# EAGLE design Iridium_9603_Beacon (EAGLE 7.6.0)

## Sheet 1 of 5
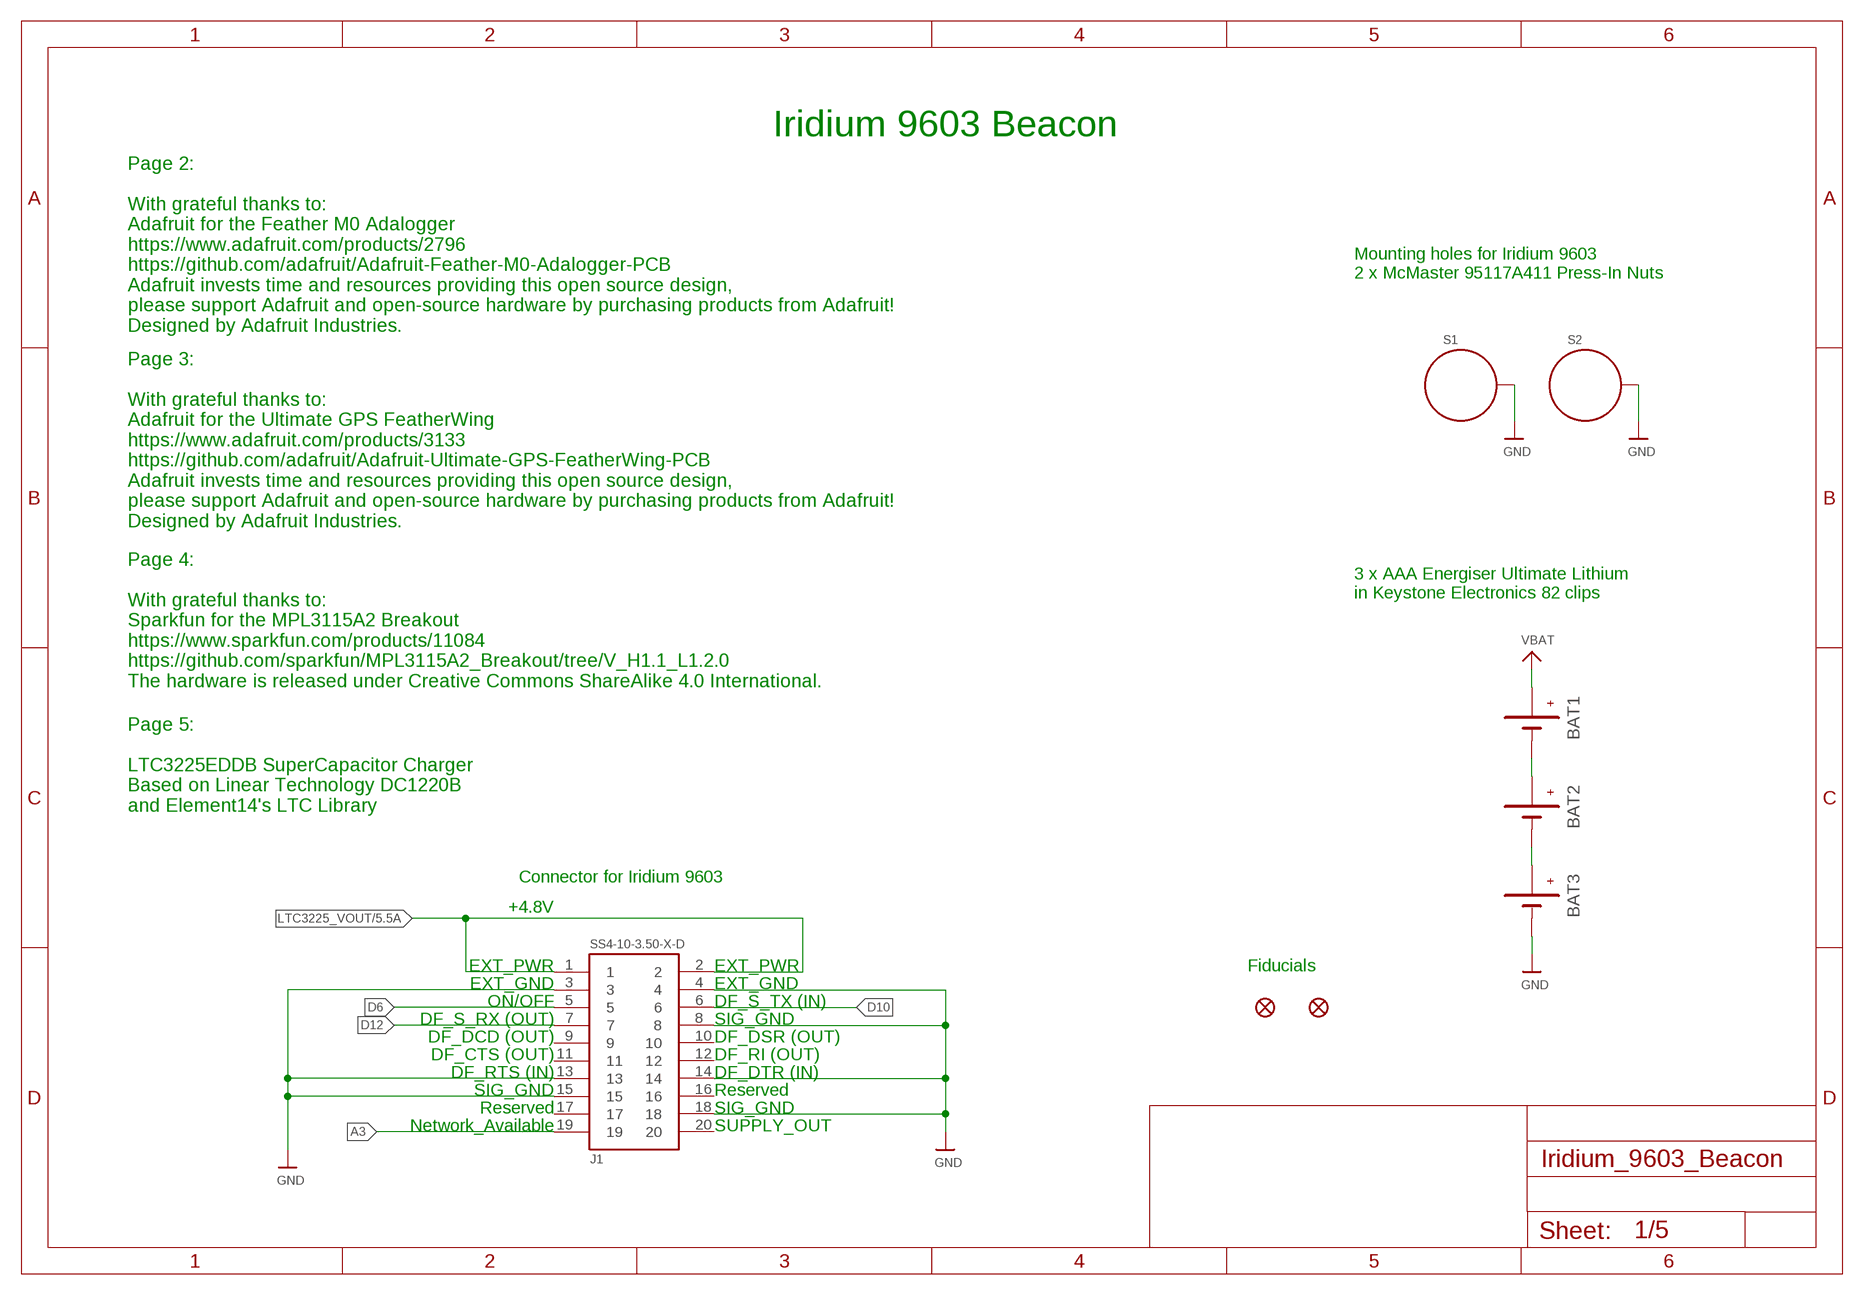
[diagram p0: schematic, sheet 1]

### Parts
BAT1  BATTERYKEYSTONE82  [BATTERY-AAA-KEYSTONE82]
BAT2  BATTERYKEYSTONE82  [BATTERY-AAA-KEYSTONE82]
BAT3  BATTERYKEYSTONE82  [BATTERY-AAA-KEYSTONE82]
FD1  FIDUCIAL1X2  [FIDUCIAL-1X2]
FD2  FIDUCIAL1X2  [FIDUCIAL-1X2]
J1  SS4-10-3.50-X-D  [SS4-10-3.50-X-D]
S1  STANDOFF_ELECTRICALMCMASTER-95117A411  [STANDOFF-ELECTRICAL-MCMASTER-95117A411]
S2  STANDOFF_ELECTRICALMCMASTER-95117A411  [STANDOFF-ELECTRICAL-MCMASTER-95117A411]

### Nets
A3: J1.19 ; also sheet 2
D6: J1.5 ; also sheet 2
D10: J1.6 ; also sheet 2
D12: J1.7 ; also sheet 2
GND: BAT3.GND@1(-) BAT3.GND@2(-) J1.3 J1.4 J1.8 J1.13 J1.14 J1.15 J1.18 S1.P1 S2.P1 ; also sheet 2,3,4,5
LTC3225_VOUT: J1.1 J1.2 ; also sheet 5
N$1: BAT2.GND@1(-) BAT2.GND@2(-) BAT3.PWR@1(+) BAT3.PWR@2(+)
N$3: BAT1.GND@1(-) BAT1.GND@2(-) BAT2.PWR@1(+) BAT2.PWR@2(+)
VBAT: BAT1.PWR@1(+) BAT1.PWR@2(+) ; also sheet 2,5
Unconnected: J1.9 J1.10 J1.11 J1.12 J1.16 J1.17 J1.20

### Notes on the sheet
- Iridium 9603 Beacon
- Mounting holes for Iridium 9603
  2 x McMaster 95117A411 Press-In Nuts
- Page 2:
  
  With grateful thanks to:
  Adafruit for the Feather M0 Adalogger
  https://www.adafruit.com/products/2796
  https://github.com/adafruit/Adafruit-Feather-M0-Adalogger-PCB
  Adafruit invests time and resources providing this open source design,
  please support Adafruit and open-source hardware by purchasing products from Adafruit!
  Designed by Adafruit Industries.
- Page 3:
  
  With grateful thanks to:
  Adafruit for the Ultimate GPS FeatherWing
  https://www.adafruit.com/products/3133
  https://github.com/adafruit/Adafruit-Ultimate-GPS-FeatherWing-PCB
  Adafruit invests time and resources providing this open source design,
  please support Adafruit and open-source hardware by purchasing products from Adafruit!
  Designed by Adafruit Industries.
- 3 x AAA Energiser Ultimate Lithium
  in Keystone Electronics 82 clips
- Page 4:
  
  With grateful thanks to:
  Sparkfun for the MPL3115A2 Breakout
  https://www.sparkfun.com/products/11084
  https://github.com/sparkfun/MPL3115A2_Breakout/tree/V_H1.1_L1.2.0
  The hardware is released under Creative Commons ShareAlike 4.0 International.
- Page 5:
  
  LTC3225EDDB SuperCapacitor Charger
  Based on Linear Technology DC1220B
  and Element14's LTC Library
- Connector for Iridium 9603
- +4.8V
- EXT_PWR | EXT_PWR | Fiducials
- EXT_GND | EXT_GND
- ON/OFF | DF_S_TX (IN)
- DF_S_RX (OUT) | SIG_GND
- DF_DCD (OUT) | DF_DSR (OUT)
- DF_CTS (OUT) | DF_RI (OUT)
- DF_RTS (IN) | DF_DTR (IN)
- SIG_GND | Reserved
- Reserved | SIG_GND
- Network_Available | SUPPLY_OUT

## Sheet 2 of 5
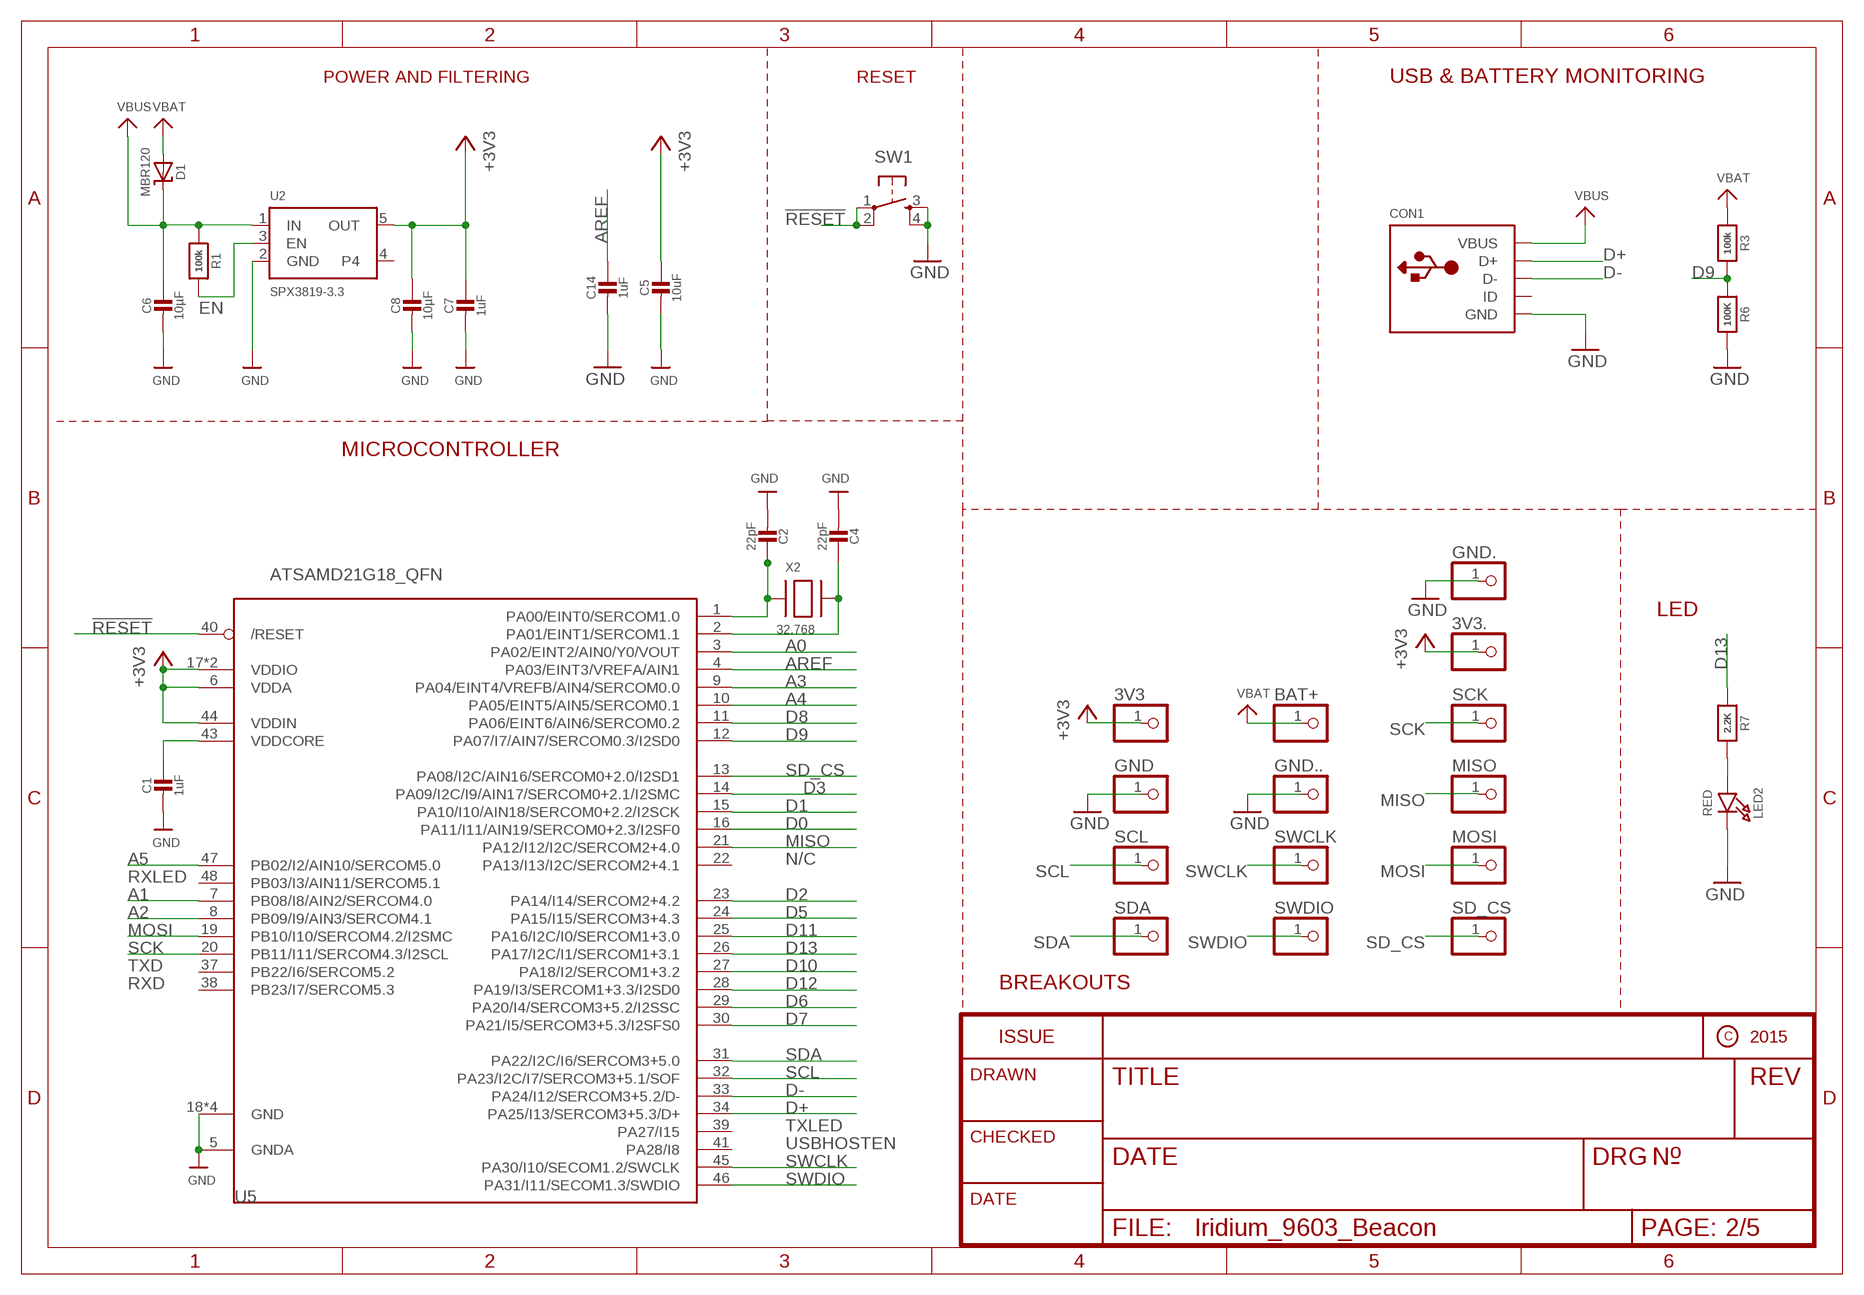
[diagram p1: schematic, sheet 2]

### Parts
3V3  PINHD-1X1  [1X01]
3V3.  PINHD-1X1  [1X01]
BAT+  PINHD-1X1  [1X01]
C1  1uF  CAP_CERAMIC0603_NO  [0603-NO]
C2  22pF  CAP_CERAMIC0603_NO  [0603-NO]
C4  22pF  CAP_CERAMIC0603_NO  [0603-NO]
C5  10uF  CAP_CERAMIC0805-NOOUTLINE  [0805-NO]
C6  10µF  CAP_CERAMIC0805-NOOUTLINE  [0805-NO]
C7  1uF  CAP_CERAMIC0603_NO  [0603-NO]
C8  10µF  CAP_CERAMIC0805-NOOUTLINE  [0805-NO]
C14  1uF  CAP_CERAMIC0603_NO  [0603-NO]
CON1  USBFCI_10103594  [FCI_10103594]
D1  MBR120  DIODE-SCHOTTKYSOD-123  [SOD-123]
GND  PINHD-1X1  [1X01]
GND.  PINHD-1X1  [1X01]
GND..  PINHD-1X1  [1X01]
LED2  RED  LED0805_NOOUTLINE  [CHIPLED_0805_NOOUTLINE]
MISO  PINHD-1X1  [1X01]
MOSI  PINHD-1X1  [1X01]
R1  100k  RESISTOR_0603_NOOUT  [0603-NO]
R3  100k  RESISTOR_0603_NOOUT  [0603-NO]
R6  100K  RESISTOR_0603_NOOUT  [0603-NO]
R7  2.2K  RESISTOR_0603_NOOUT  [0603-NO]
SCK  PINHD-1X1  [1X01]
SCL  PINHD-1X1  [1X01]
SD_CS  PINHD-1X1  [1X01]
SDA  PINHD-1X1  [1X01]
SW1  SWITCH_SPST_4_PINRECT  [TACTILE_SWITCH_SMD_4.6X2.8MM]
SWCLK  PINHD-1X1  [1X01]
SWDIO  PINHD-1X1  [1X01]
U2  SPX3819-3.3  VREG_SOT23-5  [SOT23-5]
U5  ATSAMD21G18_QFN  ATSAMD21J_QFN  [TQFN48_7MM]
X2  32.768  XTAL-3.2X1.5  [XTAL3215]

### Nets
!RESET: SW1.1 SW1.2 U5.40(/RESET)
+3V3: 3V3.1 3V3..1 C5.1 C7.1 C8.1 U2.5(OUT) U5.6(VDDA) U5.17(VDDIO) U5.36(VDDIO) U5.44(VDDIN) ; also sheet 3,5
A0: U5.3(PA02/EINT2/AIN0/Y0/VOUT)
A1: U5.7(PB08/I8/AIN2/SERCOM4.0) ; also sheet 5
A2: U5.8(PB09/I9/AIN3/SERCOM4.1)
A3: U5.9(PA04/EINT4/VREFB/AIN4/SERCOM0.0) ; also sheet 1
A4: U5.10(PA05/EINT5/AIN5/SERCOM0.1)
A5: U5.47(PB02/I2/AIN10/SERCOM5.0)
AREF: C14.1 U5.4(PA03/EINT3/VREFA/AIN1)
D0: U5.16(PA11/I11/AIN19/SERCOM0+2.3/I2SF0) ; also sheet 3
D1: U5.15(PA10/I10/AIN18/SERCOM0+2.2/I2SCK) ; also sheet 3
D2: U5.23(PA14/I14/SERCOM2+4.2)
D3: U5.14(PA09/I2C/I9/AIN17/SERCOM0+2.1/I2SMC)
D5: U5.24(PA15/I15/SERCOM3+4.3) ; also sheet 5
D6: U5.29(PA20/I4/SERCOM3+5.2/I2SSC) ; also sheet 1
D7: U5.30(PA21/I5/SERCOM3+5.3/I2SFS0)
D8: U5.11(PA06/EINT6/AIN6/SERCOM0.2)
D9: R3.2 R6.1 U5.12(PA07/I7/AIN7/SERCOM0.3/I2SD0)
D10: U5.27(PA18/I2/SERCOM1+3.2) ; also sheet 1
D11: U5.25(PA16/I2C/I0/SERCOM1+3.0) ; also sheet 3
D12: U5.28(PA19/I3/SERCOM1+3.3/I2SD0) ; also sheet 1
D13: R7.1 U5.26(PA17/I2C/I1/SERCOM1+3.1)
D+: CON1.D+ U5.34(PA25/I13/SERCOM3+5.3/D+)
D-: CON1.D- U5.33(PA24/I12/SERCOM3+5.2/D-)
EN: R1.2 U2.3(EN)
GND: C1.2 C2.2 C4.2 C5.2 C6.2 C7.2 C8.2 C14.2 CON1.BASE@1(GND) CON1.BASE@2(GND) CON1.GND CON1.SPRT@1(GND) CON1.SPRT@2(GND) CON1.SPRT@3(GND) CON1.SPRT@4(GND) GND.1 GND..1 GND...1 LED2.C R6.2 SW1.3 SW1.4 U2.2(GND) U5.5(GNDA) U5.18(GND) U5.35(GND) U5.42(GND) U5.THERMAL(GND) ; also sheet 1,3,4,5
MISO: MISO.1 U5.21(PA12/I12/I2C/SERCOM2+4.0)
MOSI: MOSI.1 U5.19(PB10/I10/SERCOM4.2/I2SMC)
N$2: LED2.A R7.2
N$5: C2.1 U5.1(PA00/EINT0/SERCOM1.0) X2.P$1
N$7: C4.1 U5.2(PA01/EINT1/SERCOM1.1) X2.P$2
SCK: SCK.1 U5.20(PB11/I11/SERCOM4.3/I2SCL)
SCL: SCL.1 U5.32(PA23/I2C/I7/SERCOM3+5.1/SOF) ; also sheet 4
SD_CS: SD_CS.1 U5.13(PA08/I2C/AIN16/SERCOM0+2.0/I2SD1)
SDA: SDA.1 U5.31(PA22/I2C/I6/SERCOM3+5.0) ; also sheet 4
SWCLK: SWCLK.1 U5.45(PA30/I10/SECOM1.2/SWCLK)
SWDIO: SWDIO.1 U5.46(PA31/I11/SECOM1.3/SWDIO)
VBAT: BAT+.1 D1.A R3.1 ; also sheet 1,5
VBUS: C6.1 CON1.VBUS D1.C R1.1 U2.1(IN)
VDDCORE1: C1.1 U5.43(VDDCORE)
Unconnected: CON1.ID U2.4 U5.22(PA13/I13/I2C/SERCOM2+4.1) U5.37(PB22/I6/SERCOM5.2) U5.38(PB23/I7/SERCOM5.3) U5.39(PA27/I15) U5.41(PA28/I8) U5.48(PB03/I3/AIN11/SERCOM5.1)

### Notes on the sheet
- POWER AND FILTERING | RESET | USB & BATTERY MONITORING
- MICROCONTROLLER
- LED
- N/C
- RXLED
- TXD
- RXD | BREAKOUTS
- TXLED
- USBHOSTEN

## Sheet 3 of 5
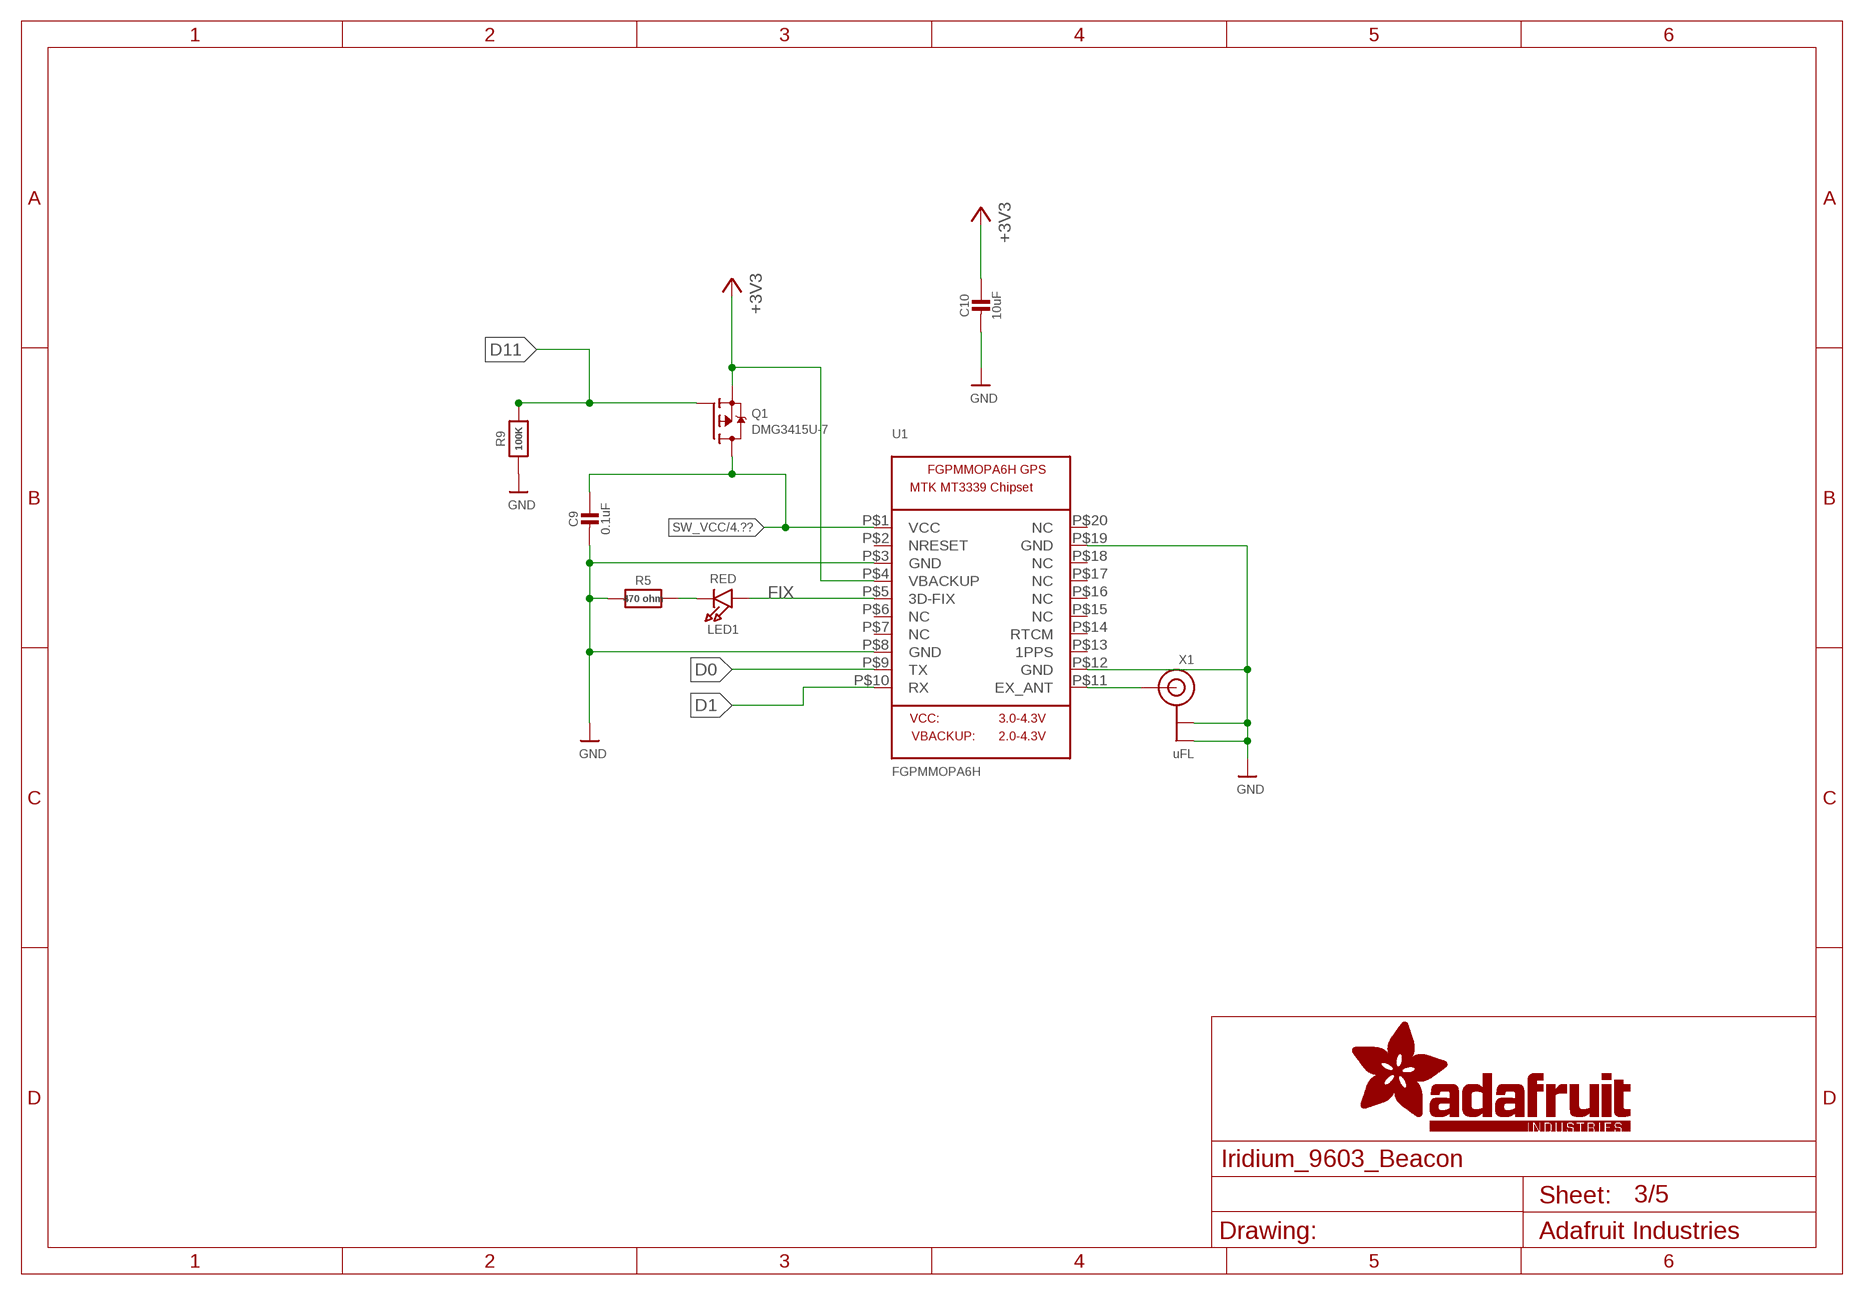
[diagram p2: schematic, sheet 3]

### Parts
C9  0.1uF  CAP_CERAMIC0805-NOOUTLINE  [0805-NO]
C10  10uF  CAP_CERAMIC0805-NOOUTLINE  [0805-NO]
LED1  RED  LED0805_NOOUTLINE  [CHIPLED_0805_NOOUTLINE]
Q1  DMG3415U-7  MOSFET-PWIDE  [SOT23-WIDE]
R5  470 ohm  RESISTOR0805_NOOUTLINE  [0805-NO]
R9  100K  RESISTOR0805_NOOUTLINE  [0805-NO]
U1  FGPMMOPA6H  GPS_FGPMMOPA6H  [FGPMMOPA6H]
X1  uFL  ANTENNA_U.FL  [U.FL]

### Nets
+3V3: C10.1 Q1.2(S) U1.P$4(VBACKUP) ; also sheet 2,5
D0: U1.P$9(TX) ; also sheet 2
D1: U1.P$10(RX) ; also sheet 2
D11: Q1.1(G) R9.2 ; also sheet 2
FIX: LED1.A U1.P$5(3D-FIX)
GND: C9.2 C10.2 R5.1 R9.1 U1.P$3(GND) U1.P$8(GND) U1.P$12(GND) U1.P$19(GND) X1.1(GND) X1.2(GND) ; also sheet 1,2,4,5
N$4: U1.P$11(EX_ANT) X1.3(SIGNAL)
N$8: LED1.C R5.2
SW_VCC: C9.1 Q1.3(D) U1.P$1(VCC) ; also sheet 4
Unconnected: U1.P$2(NRESET) U1.P$6(NC) U1.P$7(NC) U1.P$13(1PPS) U1.P$14(RTCM) U1.P$15(NC) U1.P$16(NC) U1.P$17(NC) U1.P$18(NC) U1.P$20(NC)

## Sheet 4 of 5
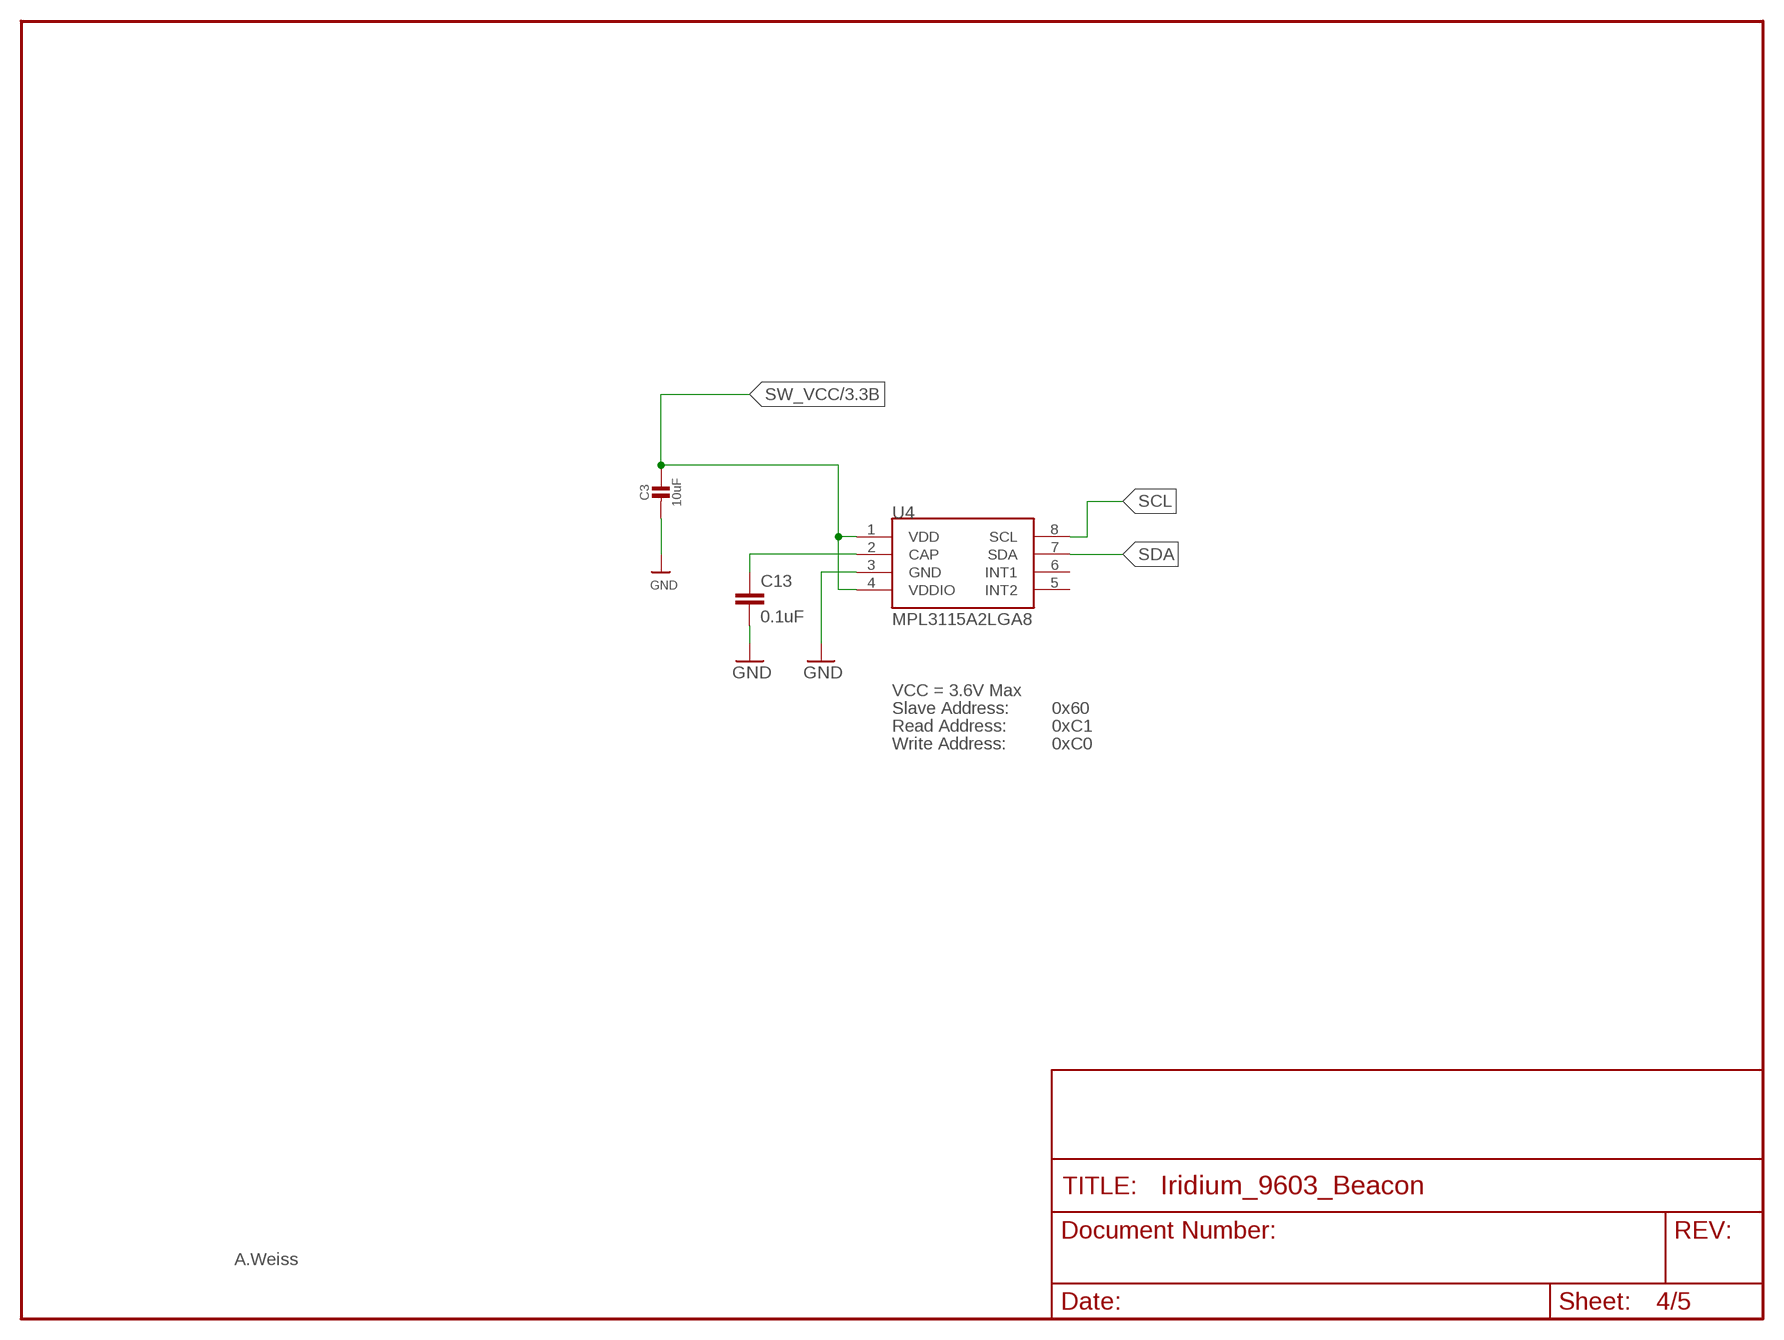
[diagram p3: schematic, sheet 4]

### Parts
C3  10uF  CAP_CERAMIC0805-NOOUTLINE  [0805-NO]
C13  0.1uF  CAP0402-CAP  [0402-CAP]
U4  MPL3115A2LGA8  [LGA8]

### Nets
GND: C3.2 C13.2 U4.3(GND) ; also sheet 1,2,3,5
N$25: C13.1 U4.2(CAP)
SCL: U4.8(SCL) ; also sheet 2
SDA: U4.7(SDA) ; also sheet 2
SW_VCC: C3.1 U4.1(VDD) U4.4(VDDIO) ; also sheet 3
Unconnected: U4.5(INT2) U4.6(INT1)

### Notes on the sheet
- VCC = 3.6V Max
- Slave Address: | 0x60
- Read Address: | 0xC1
- Write Address: | 0xC0
- A.Weiss

## Sheet 5 of 5
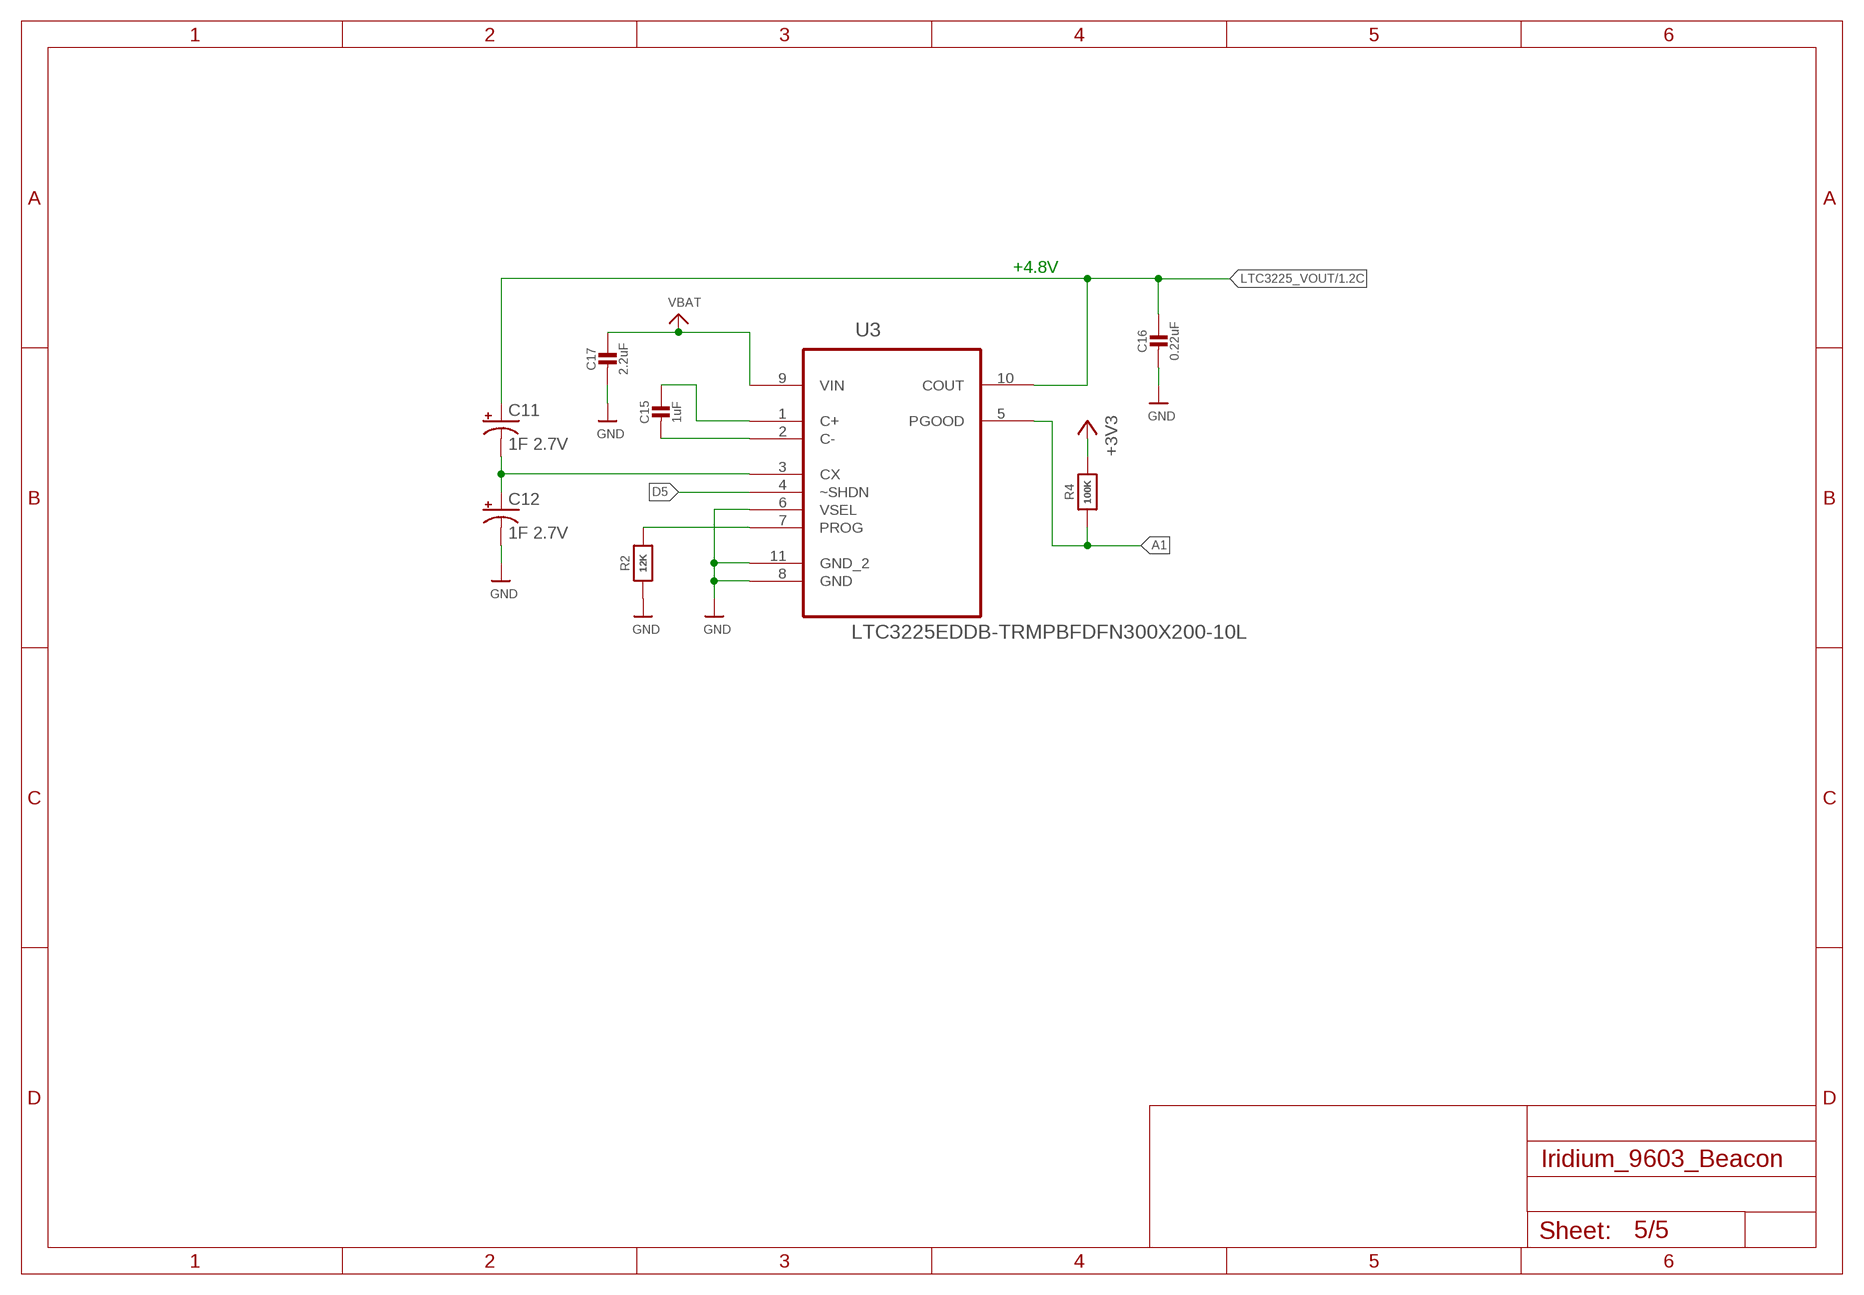
[diagram p4: schematic, sheet 5]

### Parts
C11  1F 2.7V  1F-2.7V(PTH)CPOL-RADIAL-1H-2.7V  [CPOL-RADIAL-1F-2.7V]
C12  1F 2.7V  1F-2.7V(PTH)CPOL-RADIAL-1H-2.7V  [CPOL-RADIAL-1F-2.7V]
C15  1uF  CAP_CERAMIC0603_NO  [0603-NO]
C16  0.22uF  CAP_CERAMIC0603_NO  [0603-NO]
C17  2.2uF  CAP_CERAMIC0805-NOOUTLINE  [0805-NO]
R2  12K  RESISTOR0805_NOOUTLINE  [0805-NO]
R4  100K  RESISTOR0805_NOOUTLINE  [0805-NO]
U3  LTC3225EDDB-TRMPBFDFN300X200-10L  [DFN300X200-10L]

### Nets
+3V3: R4.2 ; also sheet 2,3
A1: R4.1 U3.5(PGOOD) ; also sheet 2
D5: U3.4(~SHDN) ; also sheet 2
GND: C12.- C16.2 C17.2 R2.1 U3.6(VSEL) U3.8(GND) U3.11(GND_2) ; also sheet 1,2,3,4
LTC3225_VOUT: C11.+ C16.1 U3.10(COUT) ; also sheet 1
N$6: C11.- C12.+ U3.3(CX)
N$9: C15.2 U3.2(C-)
N$10: C15.1 U3.1(C+)
N$11: R2.2 U3.7(PROG)
VBAT: C17.1 U3.9(VIN) ; also sheet 1,2

### Notes on the sheet
- +4.8V

## Library data of the parts
3V3 3V3. BAT+ GND GND. GND.. MISO MOSI SCK SCL SD_CS SDA SWCLK SWDIO = adafruit:PINHD-1X1: Pin header 1x1 for 0.1" spacing With round pins
BAT1-BAT3 = SparkFun-Electromechanical:BATTERY: Battery Holders Various common sizes : AA, AAA, 18650 (PRT-12895), 20mm coin cell and 12mm coin cell. 20MM_4LEGS, BATT-10373
C1-C10 C14-C17 = microbuilder:CAP_CERAMIC: Ceramic Capacitors For new designs, use the packages preceded by an '_' character since they are more reliable: The following footprints should be used on most boards: _0402 - Standard footprint for regular board layouts _0603 - Standard footprint for regular board layouts _0805 - Standard footprint for regular board layouts _1206 - Standard footprint for regular board layouts For extremely tight-pitch boards where space is at a premium, the following 'micro-pitch' footprints can be used (smaller pads, no silkscreen outline, etc.): _0402MP - Micro-pitch footprint for very dense/compact boards _0603MP - Micro-pitch footprint for very dense/compact boards _0805MP - Micro-pitch footprint for very dense/compact boards _1206MP - Micro-pitch footprint for very dense/compact boards
C11 C12 = SparkFun-Capacitors:1F-2.7V(PTH): CAP-08070
C13 = SparkFun:CAP: Capacitor Standard 0603 ceramic capacitor, and 0.1" leaded capacitor.
CON1 = microbuilder:USB: USB Connectors USBMINIB - Surface Mount Female Mini-B USB Connector 4UConnector: 06564
D1 = microbuilder:DIODE-SCHOTTKY
FD1 FD2 = SparkFun-Aesthetics:FIDUCIAL: Fiducial Alignment Points Various fiducial points for machine vision alignment.
J1 = SS4-10-3.50-X-D:SS4-10-3.50-X-D: 0.4mm[.016] SOCKET STRIP ASSEMBLY.
LED1 LED2 = microbuilder:LED: LED 0603 - 0603 Surface Mount Package 2mA: Green LED - Low Power (3.9mcd, 2ma, 1.7Vf) - Digikey: 475-2709-2-ND Orange LED - Low Power (9.8mcd, 2ma, 1.8Vf) - Digikey: 475-1194-2-ND Red LED - Low Power (5mcd, 2ma, 1.8Vf) - Digikey: 475-1195-2-ND Yellow LED - Low Power (7mcd, 2ma, 1.8Vf) - Digikey: 475-1196-2-ND 5mA: Blue LED - Low Power (17mcd, 5ma, 2.9Vf) - Digikey: LNJ937W8CRACT-ND 0805 - 0805 Surface Mount Package 2mA: Red LED (8.8mcd, 2mA, 1.8Vf, Clear) - Low Power [Digikey: 475-2510-1-ND] Green LED (5mcd, 2mA, 1.8Vf, Clear) - Low Power [Digikey: 475-2730-1-ND] Yellow LED (11.3mcd, 2mA, 1.8Vf, Clear) - Low Power [Digikey: 475-2555-1-ND] 20mA: Red LED (104mcd, 20mA, Diffused) - LS R976 [Digikey: 475-1278-6-ND] Red LED (12mcd, 20mA, 2.0Vf, Clear) - APT2012EC [Digikey: 754-1128-1-ND] Green LED (15mcd, 20mA, 2.2Vf, Clear) - APT2012GC [Digikey: 754-1131-1-ND] Orange LED (160mcd, 20mA, 2.1Vf, Clear) - APT2012SECK [Digikey: 754-1130-1-ND] 1206 - 1206 Surface Mount Package Green LED (26mcd, 20mA, Diffused) - LG N971 [Digikey: 475-1407-6-ND] Red LED (15mcd, 20mA, Diffused) - LH N974 [Digikey: 475-1416-6-ND] Cree - Cree High-Power Surface Mount LEDs XPEBWT-L1-0000-00D50 - White 111lm 350mA 2.9Vf 6200K 110° XTEAWT-00-0000-00000LEE3 - White 114lm 350mA 2.85Vf 5000K 115° Everlight - Everlight 45-21 Series Surface Mount LEDs 45-21/QK2C-B2832AC2CB2/2T - Warm White 2000mcd 20mA 3.25Vf 3050K 120° 45-21/LK2C-B38452C4CB2/2T - Nuetral White 2000mcd 20mA 3.25Vf 4150K 120° 45-21/LK2C-B50634C6CB2/2T - Cold White 2200mcd 20mA 3.25Vf 5650K 120° PLCC2 Reverse Mount LS T77K-J1L2-1-0-2-R18-Z - Red 11.25mcd 2mA 1.8Vf 630nm 120° LO T77K-L1M2-24-Z - Orange 19.6mcd 2mA 1.8Vf 606nm 120° LY T77K-K2M1-26-Z - Yellow 15.7mcd 2mA 1.8Vf 587nm 120°
Q1 = microbuilder:MOSFET-P: P-Channel Mosfet LEGEND VDS: Voltage Drain-Source ID: Drain Current RDS(ON): Drain-Source On-State Resistance VGS(TH): Gate-Source Threshold Voltage CISS: Drain-Source Input Capacitance SOT-23 Name VDS ID RDS(ON) VGS(TH) CISS Order Number IRLML5103 30V 760mA 600 mOhm -- 75pF @ 25V Digikey: IRLML5103PBFCT-ND IRLML6401 12V 4.3A 50 mOhm 950mV @ 250µA 830pF @ 10V Digikey: IRLML6401PBFTR-ND NTR0202PL 20V 400mA 800 mOhm 2.3V @ 250uA 70pF @ 5V Digikey: NTR0202PLT1GOSTR-ND NTR4101PT1G 20V 1.8A 85 mOhm 1.2V @ 250uA 675pF @ 10V Digikey: NTR4101PT1GOSCT-ND DMP2004K 20V 600mA 900 mOhm 1V @ 250uA 175pF @ 16V Digikey: DMP2004KDICT-ND PMV65XP 20V 3.9A 76 mOhm 950mV @ 1mA 725pF @ 20V Digikey: 568-2358-2-ND TO-252 Name VDS ID RDS(ON) VGS(TH) CISS Order Number AOD417 30V 25A 34 mOhm 3V @ 250µA 920pF @ 15V Digikey: 785-1106-2-ND
R1-R7 R9 = microbuilder:RESISTOR: Resistors For new designs, use the packages preceded by an '_' character since they are more reliable: The following footprints should be used on most boards: _0402 - Standard footprint for regular board layouts _0603 - Standard footprint for regular board layouts _0805 - Standard footprint for regular board layouts _1206 - Standard footprint for regular board layouts For extremely tight-pitch boards where space is at a premium, the following 'micro-pitch' footprints can be used (smaller pads, no silkscreen outline, etc.): _0402MP - Micro-pitch footprint for very dense/compact boards _0603MP - Micro-pitch footprint for very dense/compact boards _0805MP - Micro-pitch footprint for very dense/compact boards _1206MP - Micro-pitch footprint for very dense/compact boards
S1 S2 = SparkFun-Electromechanical:STANDOFF_ELECTRICAL: A standoff intended to be an electrically connected point.
SW1 = SparkFun-Electromechanical:SWITCH_SPST_4_PIN; PROD_ID: SWCH-13065
U1 = microbuilder:GPS_FGPMMOPA6H: GPS Module - MTK MT3339 Chipset, -165dBm sensitivity, 22 channels, 10Hz, auto-select external antenna options
U2 = microbuilder:VREG_SOT23-5: SOT23-5 Fixed Voltage Regulators Part Current Out V Out V In V Dropout θJA (°C/W) TJ (°C) Digikey Part No. ADP121 150mA 3.3V 3.4-5.5V 0.09V @ 150mA -- -- ADP121-AUJZ33R7CT-ND ADP121 150mA 3.0V 3.1-5.5V 0.09V @ 150mA -- -- ADP121-AUJZ30R7CT-ND ADP122 300mA 3.3V 3.4-5.5V 0.085V @ 300mA -- -- ADP122AUJZ-3.3-R7CT-ND ADP1712 300mA 3.3V 3.5-5.5V 0.17V @ 300mA -- -- ADP1712AUJZ-3.3-R7TR-ND AP7311 (Low Cost) 150mA 3.3V 3.5-6V 0.15V @ 150mA -- -- AP7311-33WG-7DICT-ND LD39015M18R 150mA 1.8V 1.9V-5.5V 0.08V @ 100mA -- -- 497-6977-1-ND LP2985A-33DBVR 150mA 3.3V 3.3-16V 0.28V @ 150mA 206 150 296-18479-1-ND MCP1824T-3302E/OT 300mA 3.3V 3.5V-6V 0.2V @ 300mA -- -- MCP1824T-3302E/OTCT-ND MIC5205-2.5YM5 TR 150mA 2.5V 2.7-16V 0.165V @ 150mA -- -- 576-1257-2-ND MIC5205-3.0YM5 TR 150mA 3.0V 3.2V-16V 0.165V @ 150mA -- -- 576-1258-2-ND MIC5205-3.3YM5 TR 150mA 3.3V 3.5V-16V 0.165V @ 150mA -- -- 576-1259-2-ND TPS780330220 150mA 3.3V+2.2V 3.6-5.5V 250mV Max -- -- 296-23332-1-ND TDA3663/N1,135 100mA 3.3V 3.5-45V 0.18V @ 50mA -- -- 568-5343-1-ND Max operating temp can be calculated using θJA, TJ (max junction temperature), and power in watts. Set the "Maximum Ambient Temperature" until it reaches TJ ("Max Junction Temperature"), which is the absolute limit for safe use of the regulator: Heat Sink Temperature Calculator <http://www.daycounter.com/Calculators/Heat-Sink-Temperature-Calculator.phtml> For example, With 12V source into a 3.3V LP2985 and a 30mA load, we are dissipating (12V-3.3V) * 0.03A = 0.261W. With a θJA of 206 °C/W, a TJ of 150°C, and 261mW we can safely use the chip without a heat sink up to 75°C (=147.1°C Junction Temperature).
U3 = LTC_By_element14_Batch_1:LTC3225EDDB-TRMPBF: 150mA Supercapacitor Charger
U4 = SparkFun-Sensors:MPL3115A2: Altimeter/Pressure Sensor, I2C, 1.95V-3.6V supply, 50 to 110kPa
U5 = microbuilder:ATSAMD21J
X1 = microbuilder:ANTENNA_U.FL: U.FL Antenna Connector
X2 = adafruit2:XTAL: Low cost SMT crystals, no capacitors included http://www.ladyada.net/library/eagle

## Board
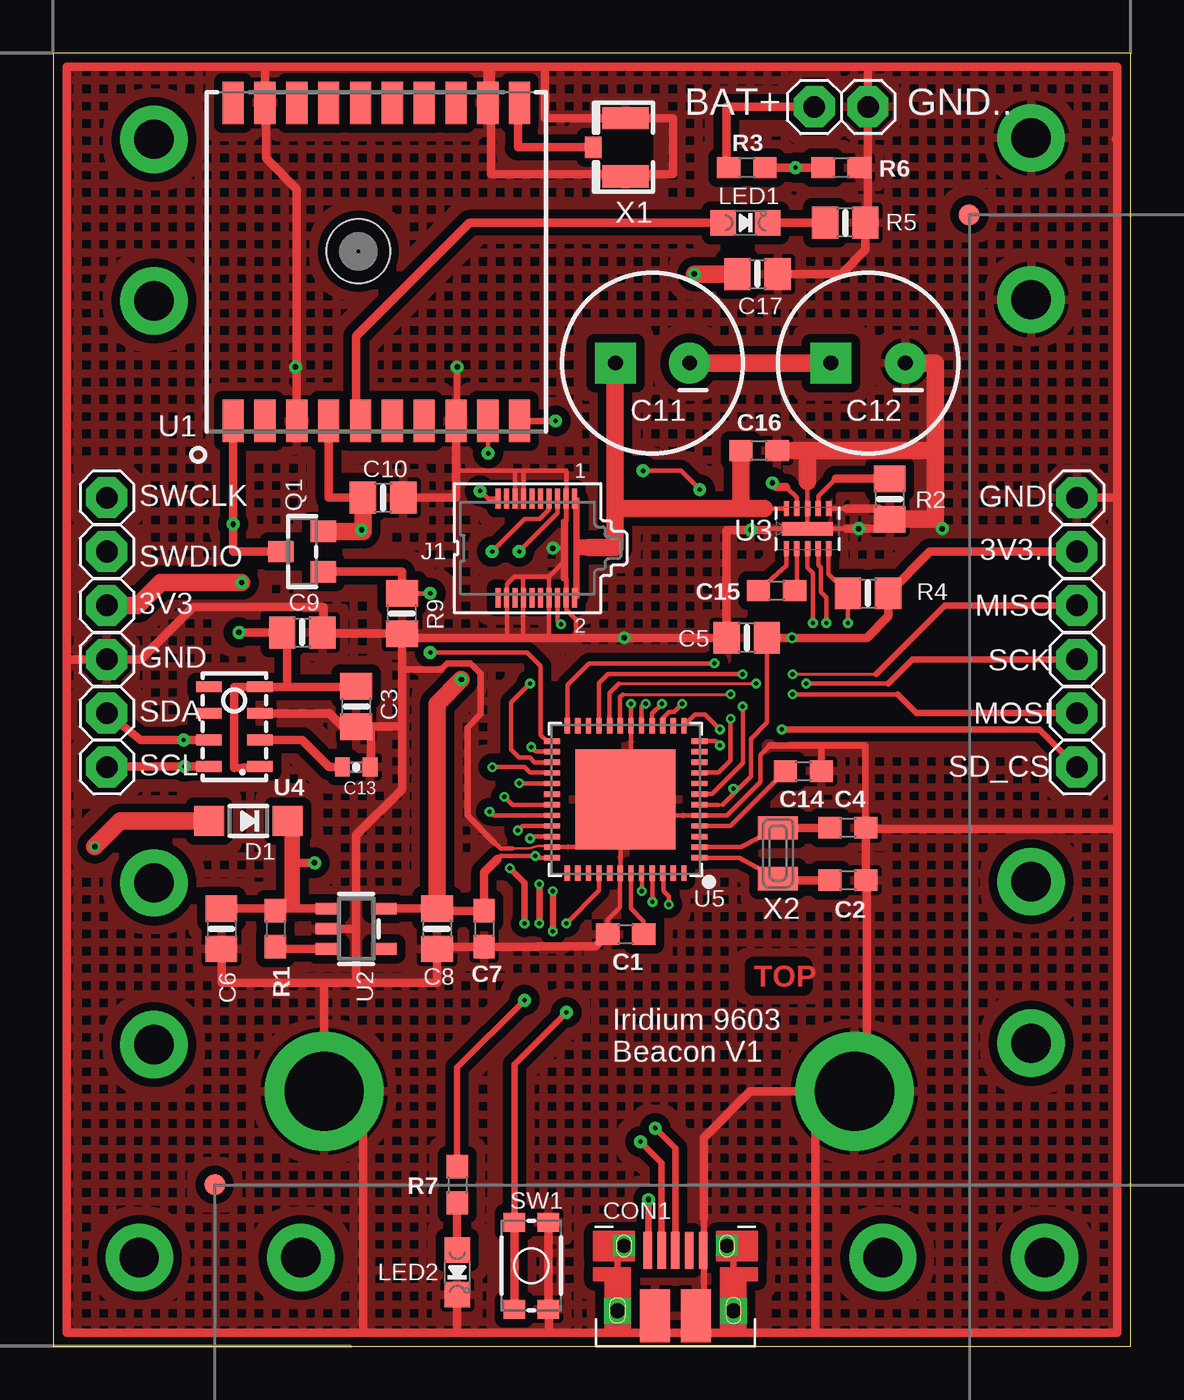
[diagram p5: board, top side]
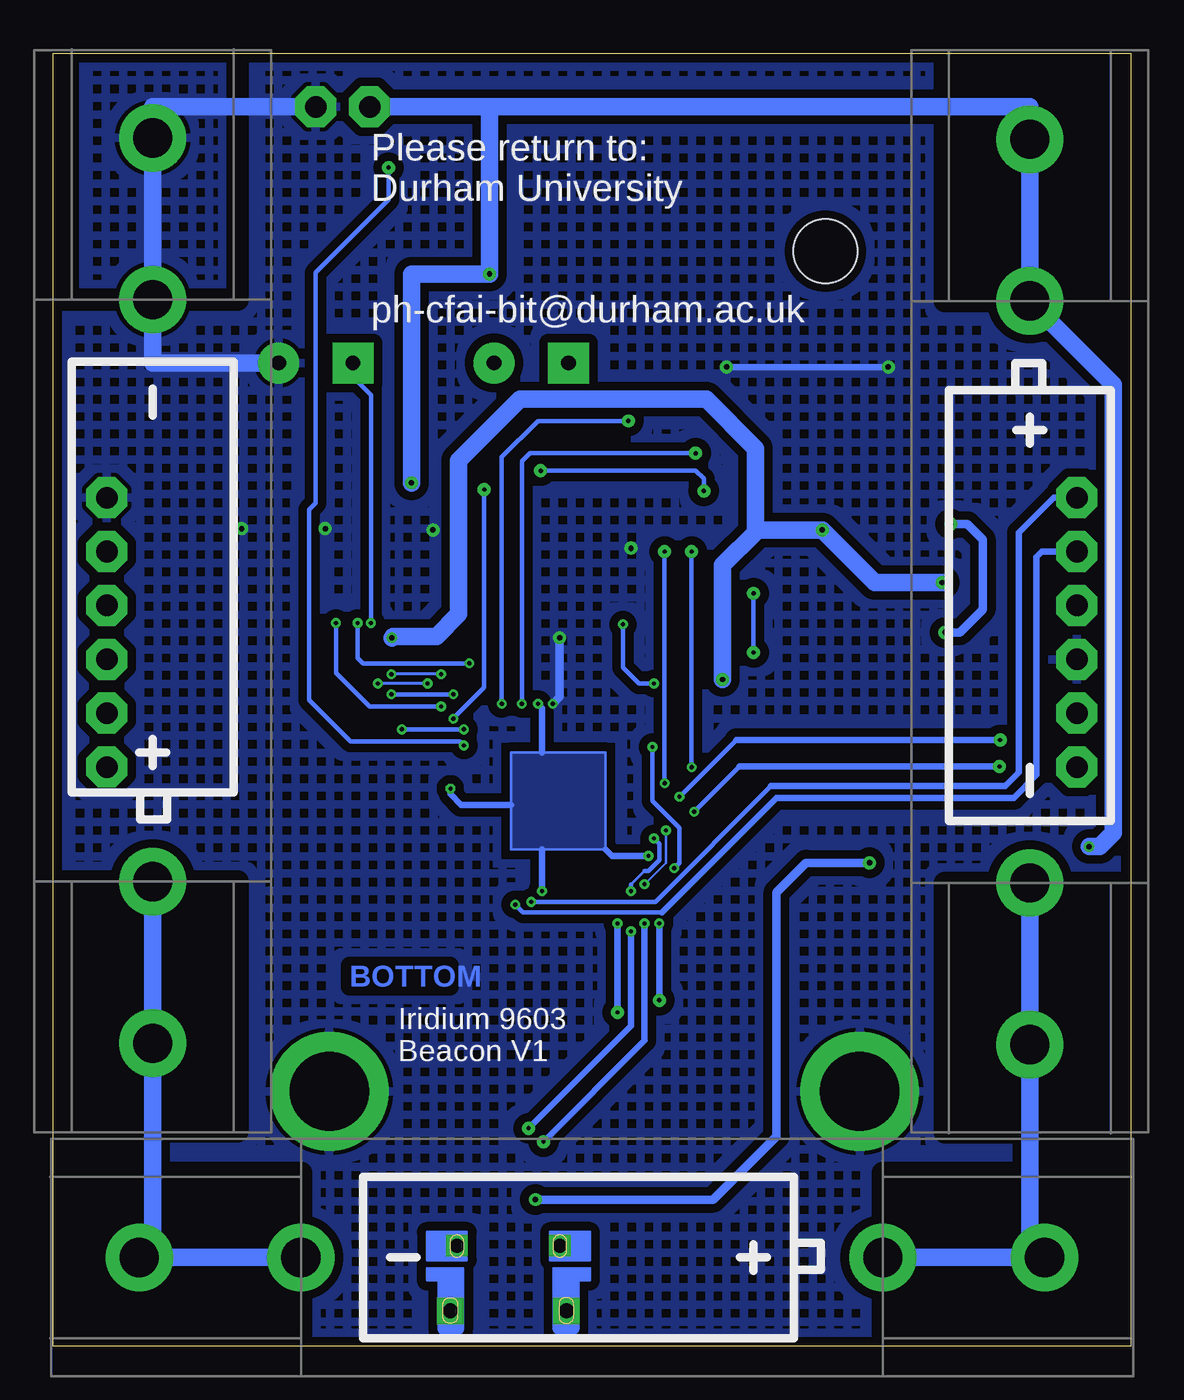
[diagram p6: board, bottom side, seen from below]

Size 50.8 x 60.96 mm. Coordinates in mm from the lower left corner, seen from the top.
Outline: 0,0 50.8,0 50.8,60.96 0,60.96 0,0
Copper layers (1*16): Top 0.018mm / dielectric 1.55mm / Bottom 0.018mm
Design rules "Multi-CB_2L_125um-Tracks_OL35um": minimum track width 0.125mm, minimum drill 0.2mm, track to track 0.125mm, track to pad 0.125mm, pad to pad 0.125mm, via to via 0.125mm, smd to smd 0mil, copper to edge 0.2mm, drill to drill 0.2mm, minimum pad ring 0.125mm, minimum via ring 0.125mm, stop-mask expansion 2mil, vias tented up to drill 0.45mm, thermal gap 0.2mm

### Footprints (pad centres in the part's own frame; a part is rotated, then mirrored left to right if it is on the bottom)
1X01 = drill 1.016 pad 1.93 octagon: 1 0,0
BATTERY-AAA-KEYSTONE82 = drill 1.854 pad 3.175: GND@1 21.336,0; GND@2 13.716,0; PWR@1 -21.336,0; PWR@2 -13.716,0
0603-NO = smd 1.1 x 1: 1 -0.85,0; 2 0.85,0
0805-NO = smd 1.24 x 1.5: 1 -0.95,0; 2 0.95,0
CPOL-RADIAL-1F-2.7V = drill 0.7 pad 1.93 square: + 1.75,0 | drill 0.7 pad 1.93: - -1.75,0
0402-CAP = smd 0.7 x 0.9: 1 -0.65,0; 2 0.65,0
FCI_10103594 = smd 1.425 x 2.5: BASE@1 -0.963,1.45; BASE@2 0.963,1.45 | smd 0.4 x 1.75: D+ 0,4.525; D- -0.65,4.525; GND 1.3,4.525; ID 0.65,4.525; VBUS -1.3,4.525 | drill 0.7 pad 1.25 square: SPRT@1 -2.736,1.679; SPRT@2 2.736,1.679 | drill 0.65 pad 1.016 square: SPRT@3 -2.426,4.747; SPRT@4 2.426,4.747
SOD-123 = smd 1.4 x 1.4: A 1.85,0; C -1.85,0
FIDUCIAL-1X2 = smd 1 x 1: 1 0,0
SS4-10-3.50-X-D = smd 0.23 x 0.93: 1 1.8,2.335; 2 1.8,-2.335; 3 1.4,2.335; 4 1.4,-2.335; 5 1,2.335; 6 1,-2.335; 7 0.6,2.335; 8 0.6,-2.335; 9 0.2,2.335; 10 0.2,-2.335; 11 -0.2,2.335; 12 -0.2,-2.335; 13 -0.6,2.335; 14 -0.6,-2.335; 15 -1,2.335; 16 -1,-2.335; 17 -1.4,2.335; 18 -1.4,-2.335; 19 -1.8,2.335; 20 -1.8,-2.335
CHIPLED_0805_NOOUTLINE = smd 1.2 x 1.2: A 0,-1.05; C 0,1.05
SOT23-WIDE = smd 1 x 1.2: 1 -0.95,-1; 2 0.95,-1; 3 0,1
STANDOFF-ELECTRICAL-MCMASTER-95117A411 = drill 3.734 pad 5.588: P1 0,0
TACTILE_SWITCH_SMD_4.6X2.8MM = smd 0.9 x 1: 1 -2.05,-0.8; 2 2.05,-0.8; 3 2.05,0.8; 4 -2.05,0.8
FGPMMOPA6H = smd 2 x 1: P$1 -7.5,6.75; P$2 -7.5,5.25; P$3 -7.5,3.75; P$4 -7.5,2.25; P$5 -7.5,0.75; P$6 -7.5,-0.75; P$7 -7.5,-2.25; P$8 -7.5,-3.75; P$9 -7.5,-5.25; P$10 -7.5,-6.75; P$11 7.5,-6.75; P$12 7.5,-5.25; P$13 7.5,-3.75; P$14 7.5,-2.25; P$15 7.5,-0.75; P$16 7.5,0.75; P$17 7.5,2.25; P$18 7.5,3.75; P$19 7.5,5.25; P$20 7.5,6.75 | hole 3: 0.5,0.85
SOT23-5 = smd 0.55 x 1.2: 1 -0.95,-1.3; 2 0,-1.3; 3 0.95,-1.3; 4 0.95,1.3; 5 -0.95,1.3
DFN300X200-10L = smd 0.711 x 0.254: 1 -0.94,0.991; 2 -0.94,0.508; 3 -0.94,0; 4 -0.94,-0.508; 5 -0.94,-0.991; 6 0.94,-0.991; 7 0.94,-0.508; 8 0.94,0; 9 0.94,0.508; 10 0.94,0.991 | smd 0.635 x 2.388: 11 0,0
LGA8 = smd 1.2 x 0.5: 1 -1.2,1.875; 2 -1.2,0.625; 3 -1.2,-0.625; 4 -1.2,-1.875; 5 1.2,-1.875; 6 1.2,-0.625; 7 1.2,0.625; 8 1.2,1.875
TQFN48_7MM = smd 0.25 x 0.75: 1 -2.75,-3.475; 2 -2.25,-3.475; 3 -1.75,-3.475; 4 -1.25,-3.475; 5 -0.75,-3.475; 6 -0.25,-3.475; 7 0.25,-3.475; 8 0.75,-3.475; 9 1.25,-3.475; 10 1.75,-3.475; 11 2.25,-3.475; 12 2.75,-3.475; 25 2.75,3.475; 26 2.25,3.475; 27 1.75,3.475; 28 1.25,3.475; 29 0.75,3.475; 30 0.25,3.475; 31 -0.25,3.475; 32 -0.75,3.475; 33 -1.25,3.475; 34 -1.75,3.475; 35 -2.25,3.475; 36 -2.75,3.475 | smd 0.75 x 0.25: 13 3.475,-2.75; 14 3.475,-2.25; 15 3.475,-1.75; 16 3.475,-1.25; 17 3.475,-0.75; 18 3.475,-0.25; 19 3.475,0.25; 20 3.475,0.75; 21 3.475,1.25; 22 3.475,1.75; 23 3.475,2.25; 24 3.475,2.75; 37 -3.475,2.75; 38 -3.475,2.25; 39 -3.475,1.75; 40 -3.475,1.25; 41 -3.475,0.75; 42 -3.475,0.25; 43 -3.475,-0.25; 44 -3.475,-0.75; 45 -3.475,-1.25; 46 -3.475,-1.75; 47 -3.475,-2.25; 48 -3.475,-2.75 | smd 4.7 x 4.7: THERMAL 0,0
U.FL = smd 2.2 x 1.05: 1 0,1.375; 2 0,-1.375 | smd 0.8 x 1: 3 1.525,0
XTAL3215 = smd 1.1 x 1.9: P$1 1.2,0; P$2 -1.2,0

### Placement (x,y rotation side)
3V3  2.54,34.92 0 top
3V3.  48.26,37.46 0 top
BAT1  4.76,35.56 270 bottom
BAT2  25.4,4.19 180 bottom
BAT3  46.1,35.62 90 bottom
BAT+  35.88,58.42 0 top
C1  26.99,19.43 180 top
C2  37.46,21.97 0 top
C3  14.29,30.16 270 top
C4  37.46,24.45 0 top
C5  32.7,33.4 180 top
C6  7.94,19.68 270 top
C7  20.32,19.68 270 top
C8  18.1,19.68 270 top
C9  11.75,33.66 0 top
C10  15.56,40 0 top
C11  28.26,46.35 180 top
C12  38.42,46.35 180 top
C13  14.29,27.3 0 top
C14  35.37,27.11 0 top
C15  34.1,35.62 0 top
C16  33.27,42.23 0 top
C17  33.21,50.55 0 top
CON1  29.34,0 0 top
D1  9.21,24.76 180 top
FD1  7.62,7.62 0 top
FD2  43.18,53.34 0 top
GND  2.54,32.38 0 top
GND.  48.26,40 0 top
GND..  38.42,58.42 0 top
J1  22.78,37.63 0 top
LED1  32.64,52.96 270 top
LED2  19.05,3.49 180 top
MISO  48.26,34.92 0 top
MOSI  48.26,29.84 0 top
Q1  11.75,37.46 90 top
R1  10.48,19.68 270 top
R2  39.43,39.94 90 top
R3  32.7,55.56 0 top
R4  38.42,35.5 0 top
R5  37.34,52.96 180 top
R6  37.15,55.56 0 top
R7  19.05,7.62 270 top
R9  16.45,34.54 90 top
S1  12.78,12.02 0 top
S2  37.78,12.02 0 top
SCK  48.26,32.38 0 top
SCL  2.54,27.3 0 top
SD_CS  48.26,27.3 0 top
SDA  2.54,29.84 0 top
SW1  22.54,3.81 270 top
SWCLK  2.54,40 0 top
SWDIO  2.54,37.46 0 top
U1  15.24,51.12 90 top
U2  14.29,19.68 270 top
U3  35.56,38.54 90 top
U4  8.54,29.21 180 top
U5  26.99,25.78 90 top
X1  26.99,56.52 180 top
X2  34.16,23.24 270 top

### Tracks (layer width: path | path; a pad name or v marks a point on that pad's centre or on a via)
!RESET  (via drill 0.2 pad 0.46, 0.2 pad 0.61)
  Top 0.203: U5.40 25.74,21.48 v24.19,19.94
  Top 0.305: v24.19,15.75 21.74,13.3 SW1.1
  Top 0.406: SW1.1 SW1.2
  Bottom 0.305: v24.19,15.75 v24.19,19.94
+3V3  (via drill 0.2 pad 0.41, 0.2 pad 0.46, 0.25 pad 0.41, 0.25 pad 0.61)
  Top 0.127: U5.6 31.56,25.53 | U5.36 23.47,22.99 | U5.44 | 20.96,22.99 21.08,23.11
  Top 0.203: 32.07,26.04 32.89,26.86 32.89,28.64 33.65,29.4 C5.1 | U5.6 31.37,25.53 | v32.07,26.29 32.07,26.04 | 32.07,26.04 31.56,25.53 | U5.17 27.74,30.15 v27.94,30.29 | U5.44 v27.75,21.46 | 21.08,23.11 v22.73,23.11 22.82,23.03 U5.36
  Top 0.406: U2.5 C8.1 18.1,20.54 C7.1 20.32,22.35 20.96,22.99 | C10.1 12.99,40 U1.P$4 | 3V3..1 41.34,37.46 R4.2 39.37,34.41 38.35,33.4 v34.83,33.4 | 34.77,33.4 C5.1
  Top 0.813: Q1.2 14.61,38.42 | 14.61,38.42 C10.1 | C8.1 18.1,30.29 v19.24,31.43 | 14.61,38.42 v14.54,38.48 | 3V3.1 4,34.92 5.08,36 v8.89,36
  Bottom 0.127: 27.74,28 24.77,28 24.77,23.43 27.75,23.43 29.21,23.43 29.21,25.53 29.21,28 27.75,28 27.74,28 | 27.74,28 U5.17
  Bottom 0.305: 29.21,25.53 31.56,25.53 32.07,26.04 v32.07,26.29 | v27.75,21.46 27.75,23.43 | 24.77,23.43 24.45,23.11 v22.73,23.11 | v27.94,30.29 27.75,30.1 27.75,28
  Bottom 0.813: v19.24,31.43 19.24,36.83 17.65,38.42 | 17.65,38.42 17.59,38.48 v14.54,38.48 12.07,36 v8.89,36 | 17.65,38.42 17.68,38.45 17.68,42.32 20,44.64 28.8,44.64 31.69,41.75 31.69,34.51 32.73,33.46 34.77,33.46 v34.83,33.4
  pour Bottom: 24.77,28 29.21,28 29.21,23.43 24.77,23.43
A1  (via drill 0.2 pad 0.46)
  Top 0.127: R4.1
  Top 0.203: U3.5 36.55,36.41 R4.1 | U5.7 31.05,26.03 32.51,27.5 v32.51,30.16 | v37.46,34.1 R4.1
  Bottom 0.203: v32.51,30.16 35.88,30.16 37.46,31.75 v37.46,34.1
A3  (via drill 0.2 pad 0.46, 0.2 pad 0.61)
  Top 0.127: 30.48,27.05 U5.9
  Top 0.203: J1.19 20.49,39.96 v20.13,40.32 | v27.81,41.27 29.59,41.27 v30.48,40.39 | 30.48,27.05 31.37,27.05 31.94,27.62 v31.94,29.59
  Bottom 0.203: v20.13,40.32 20.13,40.89 20.51,41.27 v27.81,41.27 | v30.48,40.39 30.48,31.05 v31.94,29.59
AREF
  Top 0.203: U5.4 31.94,24.53 C14.1
D0  (via drill 0.2 pad 0.46, 0.2 pad 0.61)
  Top 0.127: 20.51,43.6 U1.P$9
  Top 0.203: v20.51,42.1 20.51,43.6 | v28.7,30.29 28.24,29.83 U5.16
  Bottom 0.203: v28.7,30.29 28.7,41.72 28.32,42.1 v20.51,42.1
D1  (via drill 0.2 pad 0.46, 0.2 pad 0.61)
  Top 0.127: U1.P$10 | 28.74,29.63 U5.15
  Top 0.203: v29.65,30.29 29.27,29.91 29.02,29.91 28.74,29.63
  Top 0.305: v23.69,43.62 U1.P$10
  Bottom 0.203: v29.65,30.29 29.65,41.91 27.94,43.62 v23.69,43.62
D5  (via drill 0.2 pad 0.46)
  Top 0.127: 24.26,29.28 U5.24
  Top 0.203: U3.4 36.07,36.83 36.2,36.7 36.2,35.56 36.45,35.31 v36.45,34.1 | 24.26,29.28 24.26,31.18 25.27,32.19 v31.18,32.19
  Bottom 0.203: v36.45,34.1 36.45,32.45 36.2,32.19 v31.18,32.19
D6  (via drill 0.2 pad 0.46, 0.2 pad 0.61)
  Top 0.127: U5.29
  Top 0.203: J1.5 23.78,39.27 v21.97,37.46 | v21.97,26.54 U5.29
  Bottom 0.203: v21.97,37.46 v21.97,26.54
D9  (via drill 0.2 pad 0.46, 0.2 pad 0.61)
  Top 0.203: U5.12 31.22,28.53 v31.43,28.32
  Top 0.406: R3.2 v34.99,55.56 35.18,55.56 R6.1
  Bottom 0.203: v31.43,28.32 31.62,28.51 36.77,28.51 38.73,30.48 38.73,39.43 38.42,39.75 38.42,50.61 34.99,54.04 v34.99,55.56
D10  (via drill 0.2 pad 0.46)
  Top 0.127: 22.35,31.12 v22.48,31.24
  Top 0.203: U5.27 22.7,27.53 22.48,27.75 21.97,27.75 21.59,28.13 21.59,30.35 v22.48,31.24 | J1.6 23.78,34.2 v23.94,34.04
  Bottom 0.203: v22.48,31.24 23.18,31.24 23.94,32 v23.94,34.04
D11  (via drill 0.2 pad 0.61)
  Top 0.127: U5.25 23.29,28.53 | R9.2
  Top 0.203: 23.29,28.53 22.99,28.83 22.99,32.07 22.35,32.7 v17.78,32.7 | v17.78,35.5 R9.2
  Top 0.406: Q1.1 16.45,36.52 R9.2
  Bottom 0.203: v17.78,32.7 v17.78,35.5
D12  (via drill 0.2 pad 0.46, 0.2 pad 0.61)
  Top 0.127: 23.49,27.05 U5.28
  Top 0.203: v20.7,37.46 22.23,38.99 22.92,38.99 23.38,39.44 J1.7 | v20.7,27.31 22.23,27.31 22.48,27.05 23.49,27.05
  Bottom 0.203: v20.7,37.46 v20.7,27.31
D13  (via drill 0.2 pad 0.46, 0.2 pad 0.61)
  Top 0.203: v22.54,28.26 22.77,28.03 U5.26
  Top 0.305: R7.1 19.05,13.14 v22.23,16.32 | v22.23,19.94 22.23,21.84 v21.53,22.54
  Bottom 0.203: v22.54,28.26 22.54,25.72 21.27,24.45 21.27,22.8 v21.53,22.54
  Bottom 0.305: v22.23,16.32 v22.23,19.94
D+  (via drill 0.2 pad 0.46, 0.2 pad 0.61)
  Top 0.203: U5.34 22.57,24.03 v22.48,23.94
  Top 0.305: 28.57,10.1 v28.38,10.29 29.34,9.33 CON1.D+ | v23.56,21.46 v23.56,19.56
  Bottom 0.152: 22.92,22.42 23.56,21.78
  Bottom 0.203: v22.48,23.94 22.23,23.69 22.23,22.92 22.73,22.42 22.92,22.42 | 23.56,21.78 v23.56,21.46
  Bottom 0.305: v28.38,10.29 23.56,15.11 v23.56,19.56
D-  (via drill 0.2 pad 0.46, 0.2 pad 0.61)
  Top 0.203: U5.33 22.12,24.53 v21.91,24.32
  Top 0.305: v22.92,21.78 v22.92,19.94 | v27.69,9.65 28.07,9.27 | 28.07,9.27 28.18,9.16 | CON1.D- 28.69,8.65 28.07,9.27
  Bottom 0.127: v21.91,24.32 21.91,22.8 v22.92,21.78
  Bottom 0.305: v22.92,19.94 22.92,14.41 v27.69,9.65
EN
  Top 0.406: U2.3 10.48,18.74 R1.2
FIX
  Top 0.406: LED1.A 19.62,52.96 14.29,47.63 14.29,44.13 14.49,44.13 U1.P$5
GND  (via drill 0.2 pad 0.46, 0.25 pad 0.61)
  Top 0.127: U5.THERMAL 24.74,23.53 | U5.THERMAL 26.74,25.53 | U5.THERMAL 27.74,25.03 | U5.THERMAL 27.24,26.03 | J1.4 24.19,35.29 | U5.18 | R9.1 17.02,33.59 16.38,33.4 | 12.7,33.59 C9.2 | U5.42 | C4.2 38.29,24.45 | J1.15 | J1.18 21.4,35.29 | J1.8 23.37,35.29 | 37.4,39.48 37.4,39.5 | 33.65,38.54 33.65,38.48 | 21.65,23.46 22.42,23.46 22.86,23.59 23.45,23.59 U5.35
  Top 0.203: 24.74,23.53 U5.35 | 26.74,25.53 U5.42 | 27.74,25.03 U5.5 31.76,25.03 33.34,26.61 33.34,27.88 33.78,28.32 | 27.24,26.03 U5.18 | 24.18,37.08 J1.4 24.18,37.62 v23.56,37.62 | 24.18,37.08 J1.3 24.19,39.96 | C1.2 26.14,20.11 26.73,20.7 U5.42 | J1.15 21.78,41.27 | 21.78,41.27 18.99,41.27 | 24.19,39.96 24.19,41.27 22.1,41.27 | 22.1,41.27 21.78,41.27 | 21.4,33.4 21.4,35.29 21.4,35.94 21.74,36.28 23.38,36.28 | U3.11 U3.8 35.56,40.77 | U3.6 37.4,39.48 | U3.11 37.4,38.54 | U3.11 33.65,38.54 | J1.8 23.38,36.28 | 23.38,36.28 24.18,37.08 | U5.18 v27.24,30.29 | 23.37,35.29 23.37,33.4 23.37,33.34 | 22.16,33.4 22.16,35.27 J1.14 22.16,35.31 22.16,36.26 | J1.13 22.18,41.19 22.1,41.27 | 21.65,23.46 21.08,23.46 20.77,23.78 | 24.19,39.96 24.19,38.89 24.04,38.89 24.04,36.16 24.19,36.16 24.19,34.7 24.64,34.26 24.64,33.46 24.67,33.43
  Top 0.305: 36.22,28.32 C14.2 | 38.29,24.45 38.29,28.32 36.22,28.32 | 33.78,28.32 36.22,28.32 | 30.67,6.03 30.67,4.56 CON1.GND 30.67,4.52 30.67,2.1 30.3,2.1 CON1.BASE@2 | CON1.SPRT@3 26.6,4.75 CON1.SPRT@1 26.67,1.68 26.67,0.64 | CON1.SPRT@4 32.07,4.75 CON1.SPRT@2 31.75,1.68 31.75,0.64 | v19.05,46.16 19.05,43.68 U1.P$8 | 20.77,23.78 19.53,25.02 19.53,29.18 20.16,29.81 20.16,31.72 19.68,32.19 18.57,32.19 18.29,31.91 16.45,31.91 16.51,31.97 16.51,33.46
  Top 0.406: 23.18,60.32 20.64,60.32 | 20.64,60.32 20.49,60.32 | 20.49,60.32 U1.P$12 20.64,58.62 | 20.64,58.62 20.64,60.32 | 20.49,60.32 9.99,60.32 | 9.99,60.32 U1.P$19 10.03,58.57 10.03,56.01 11.49,54.55 U1.P$3 | 26.99,55.24 29.21,55.24 29.21,57.89 X1.2 23.18,57.89 23.18,60.32 | 26.99,55.24 X1.1 | 20.64,58.62 20.64,55.24 26.99,55.24 | 23.18,60.32 38.42,60.32 | GND...1 38.42,60.32 | 38.42,60.32 50.16,60.32 50.16,56.96 | 50.16,56.96 50.16,40 | 50.16,40 50.16,24.38 | 50.16,24.38 50.16,0.64 35.94,0.64 | 9.99,60.32 0.64,60.32 0.64,32.38 | 0.64,32.38 0.64,0.64 14.61,0.64 | 14.61,0.64 19.05,0.64 | 19.05,0.64 23.37,0.64 | 23.37,0.64 26.67,0.64 31.75,0.64 35.94,0.64 | LED2.C 19.05,0.64 | 14.61,0.64 14.61,12.02 S1.P1 12.78,17.15 | S2.P1 32.85,12.02 30.67,9.84 30.67,6.03 | GND...1 38.42,52.7 R5.1 38.29,51.69 37.15,50.55 C17.2 | U2.2 14.29,19.68 | 14.29,19.68 14.29,17.15 | 14.29,17.15 12.78,17.15 | 12.78,17.15 7.94,17.15 C6.2 | 14.29,17.15 18.1,17.15 C8.2 18.1,18.83 C7.2 22.86,18.83 | R6.2 38.42,55.56 GND...1 | GND..1 50.16,40 | 0.64,32.38 GND.1 4.13,32.38 6.6,34.86 12.76,34.86 12.76,33.66 C9.2 | U4.3 13.02,29.83 13.02,29.85 13.65,29.21 C3.2 14.99,29.21 | 16.38,33.4 21.4,33.4 22.16,33.4 23.37,33.4 v26.92,33.4 | 12.7,33.59 R9.1 16.45,31.91 16.45,29.21 | 14.99,29.21 16.45,29.21 | C13.2 14.99,27.31 14.99,29.21 | C2.2 C4.2 38.38,24.38 50.16,24.38 | C10.2 18.99,40 18.99,41.27 U1.P$8 | C5.2 v26.92,33.4 | C5.2 v26.92,33.4 | 37.4,39.5 38.93,39.5 R2.1 38.99,38.54 v37.97,38.54 37.4,38.54 | 33.65,38.48 v32.89,38.48 31.75,38.48 C5.2 | 50.1,56.9 50.16,56.96 | 22.86,18.86 25.57,18.86 C1.2 | SW1.4 SW1.3 23.37,1.73 23.37,0.64 | S2.P1 35.94,12.02 35.94,0.64
  Top 0.406: S2.P1 38.35,12.6 38.35,21.94 | 14.29,19.68 14.29,24.1 16.45,26.26 16.45,29.21 | v41.91,38.54 41.91,38.64 41.53,39.02
  Top 0.813: 35.56,40.77 35.56,42.23 | 35.56,42.23 C16.2 | C12.- 41.59,46.35 41.59,38.99 R2.1 | 35.56,42.23 41.53,42.23
  Bottom 0.305: v19.05,46.16 v11.43,46.16
  Bottom 0.406: v27.24,30.29 26.92,30.61 v26.92,33.4
  Bottom 0.813: C12.- 46.1,46.35 BAT3.GND@2 BAT3.GND@1 46.1,58.42 GND...1
  pour Bottom (isolate 0.406, rank 2, hatched): 0.64,0.64 0.7,60.32 50.16,60.32 50.23,0.64
  pour Top (isolate 0.406, hatched): 0.64,0.64 0.7,60.32 50.16,60.32 50.16,0.64
LTC3225_VOUT
  Top 0.127: 24.58,37.66 J1.2 24.7,35.29 24.7,37.53 | 24.58,37.66 J1.1 24.77,39.96 24.77,37.97 | 25.27,37.66 24.58,37.66 | 24.7,37.53 24.7,37.87 | 24.7,37.87 24.7,39.94 24.57,39.94 | 24.77,37.34 24.77,35.31 24.64,35.31 | 24.77,37.78 25.08,37.78 | 24.77,37.78 24.77,37.97 | 24.77,37.97 25.27,37.97 | 24.7,37.87 25.08,37.87 25.08,37.85 | 24.77,37.78 24.77,37.34 | 24.77,37.34 25.34,37.34 | 24.89,37.53 25.15,37.53 | 24.7,37.53 24.89,37.53 | 24.89,37.53 24.89,37.4 | 33.53,39.5 33.54,39.48
  Top 0.203: 33.54,39.48 U3.10
  Top 0.813: C11.+ 26.48,46.35 26.48,39.48 | 26.48,39.48 26.48,37.66 25.27,37.66 | 32.42,39.48 C16.1 | 32.42,39.48 26.48,39.48 | 32.42,39.48 32.44,39.5 33.53,39.5
MISO  (via drill 0.2 pad 0.46)
  Top 0.152: v34.86,31.69 38.8,31.69
  Top 0.203: U5.21 25.74,31.26 26.16,31.69 v32.51,31.69
  Top 0.305: 38.8,31.69 42.04,34.92 MISO.1
  Bottom 0.152: v32.51,31.69 v34.86,31.69
MOSI  (via drill 0.2 pad 0.46)
  Top 0.127: U5.19
  Top 0.152: 26.86,30.73 v31.94,30.73
  Top 0.203: U5.19 26.73,30.61 26.86,30.73 | v34.86,30.73 39.81,30.73
  Top 0.305: 39.81,30.73 40.7,29.85 MOSI.1
  Bottom 0.203: v31.94,30.73 v34.86,30.73
N$1
  Bottom 0.813: BAT2.GND@2 BAT2.GND@1 46.1,4.19 BAT3.PWR@1 BAT3.PWR@2
N$2
  Top 0.406: R7.2 LED2.A
N$3
  Bottom 0.813: BAT2.PWR@1 4.76,4.19 | 4.76,4.19 BAT1.GND@1 BAT1.GND@2 | 4.76,4.19 BAT2.PWR@2
N$4
  Top 0.406: U1.P$11 21.91,58.62 21.91,56.52 X1.3
N$5
  Top 0.203: U5.1 32.35,23.03 X2.P$1
  Top 0.406: X2.P$1 33.46,22.04 33.46,21.97 C2.1
N$6  (via drill 0.2 pad 0.46)
  Top 0.203: U3.3 35.56,36.7 35.81,36.45 v35.81,34.1
  Top 0.813: C12.+ C11.-
  Bottom 0.203: v35.81,34.1 35.81,44.83 36.67,45.68 C12.+
N$7
  Top 0.203: U5.2 32.43,23.53 X2.P$2
  Top 0.406: X2.P$2 35.6,24.44 C4.1
N$8
  Top 0.406: LED1.C R5.2
N$9
  Top 0.127: 35.05,35.65 C15.2
  Top 0.203: U3.2 35.05,35.65
N$10
  Top 0.203: U3.1 34.57,36.82 C15.1
N$11
  Top 0.203: U3.7 36.07,40.07 36.89,40.89
  Top 0.406: 36.89,40.89 R2.2
N$25
  Top 0.406: U4.2 11.75,28.58 13.02,27.31 C13.1
SCK  (via drill 0.2 pad 0.46)
  Top 0.152: 26.67,31.24 v33.15,31.24
  Top 0.203: U5.20 26.24,30.81 26.67,31.24 | v35.5,31.24 39.37,31.24
  Top 0.305: 39.37,31.24 40.51,32.38 SCK.1
  Bottom 0.152: v33.15,31.24 v35.5,31.24
SCL  (via drill 0.2 pad 0.46, 0.2 pad 0.61)
  Top 0.203: U5.32 20.75,25.03 v20.57,25.21
  Top 0.406: U4.8 v6.19,27.33 2.54,27.33 SCL.1
  Bottom 0.203: v20.57,25.21 18.45,27.33
  Bottom 0.305: 18.45,27.33 v6.19,27.33
SD_CS  (via drill 0.2 pad 0.46)
  Top 0.203: U5.13 30.26,29.78 30.73,29.78 v31.43,29.08
  Top 0.305: v34.35,29.08 46.48,29.08 SD_CS.1
  Bottom 0.203: v31.43,29.08 v34.35,29.08
SDA  (via drill 0.2 pad 0.46, 0.2 pad 0.61)
  Top 0.203: U5.31 21.65,25.53 v21.27,25.91
  Top 0.406: U4.7 v6.16,28.58 4.13,28.58 SDA.1
  Bottom 0.203: v21.27,25.91 18.6,28.58
  Bottom 0.305: 18.6,28.58 v6.16,28.58
SW_VCC  (via drill 0.25 pad 0.61)
  Top 0.406: U4.1 8.54,27.27 8.54,31.08 U4.4 | U4.4 14.29,31.09 C3.1 | Q1.3 8.49,37.46 v8.49,38.76 U1.P$1 | v8.76,33.66 C9.1 11.04,33.66 11.04,31.09 U4.4
  Bottom 0.406: v8.49,38.76 7.7,38.76 6.99,38.04 6.99,34.73 8.07,33.66 v8.76,33.66
SWCLK  (via drill 0.2 pad 0.46)
  Top 0.127: 28.26,22.29 U5.45
  Top 0.203: v28.26,20.95 28.26,22.29
  Bottom 0.203: 16.95,26.42 22.42,20.95 v28.26,20.95
  Bottom 0.305: SWCLK.1 3.62,40 5.27,38.35 5.27,27.05 5.91,26.42 16.95,26.42
SWDIO  (via drill 0.2 pad 0.46)
  Top 0.127: 28.77,22.28 U5.46
  Top 0.203: v29.02,20.83 29.02,21.21 28.77,21.46 28.77,22.28
  Bottom 0.203: 22.1,20.45 28.64,20.45 v29.02,20.83
  Bottom 0.305: SWDIO.1 4.19,37.46 4.45,37.21 4.45,26.92 5.53,25.84 16.7,25.84 22.1,20.45
VBAT  (via drill 0.25 pad 0.41, 0.25 pad 0.61)
  Top 0.203: 34.54,40.51 35.05,40 U3.9
  Top 0.406: D1.A 7.3,24.45 | R3.1 31.75,55.56 31.75,58.42 BAT+.1 | v33.91,40.7 34.1,40.51 34.54,40.51
  Top 0.813: C17.1 v30.23,50.55 | v1.97,23.56 3.18,24.76 D1.A
  Bottom 0.813: 30.23,58.42 4.76,58.42 BAT1.PWR@1 BAT1.PWR@2 0.83,45.34 0.83,24.19 1.46,23.56 v1.97,23.56 | 30.23,58.42 BAT+.1 | 30.23,58.42 v30.23,50.55 33.91,50.55 v33.91,40.7
VBUS  (via drill 0.25 pad 0.61)
  Top 0.305: CON1.VBUS 28.07,4.52 v28.07,6.92
  Top 0.406: U2.1 11.11,20.63 | 11.11,20.63 10.48,20.63 | 10.48,20.63 R1.1 | 10.48,20.63 C6.1 | 11.11,20.63 11.11,24.76 D1.C 11.43,24.76 11.43,22.8 | 11.43,22.8 11.43,20.64 | v12.32,22.8 11.43,22.8
  Bottom 0.406: v28.07,6.92 19.68,6.92 16.7,9.91 16.7,21.4 15.3,22.8 v12.32,22.8
VDDCORE1
  Top 0.127: U5.43
  Top 0.203: U5.43 27.24,20.64 27.84,20.04 C1.1

### Text on the board
Top: TOP
Bottom: BOTTOM
tPlace: Iridium 9603 / Beacon V1
bPlace: Please return to: / Durham University / / / ph-cfai-bit@durham.ac.uk | Iridium 9603 / Beacon V1